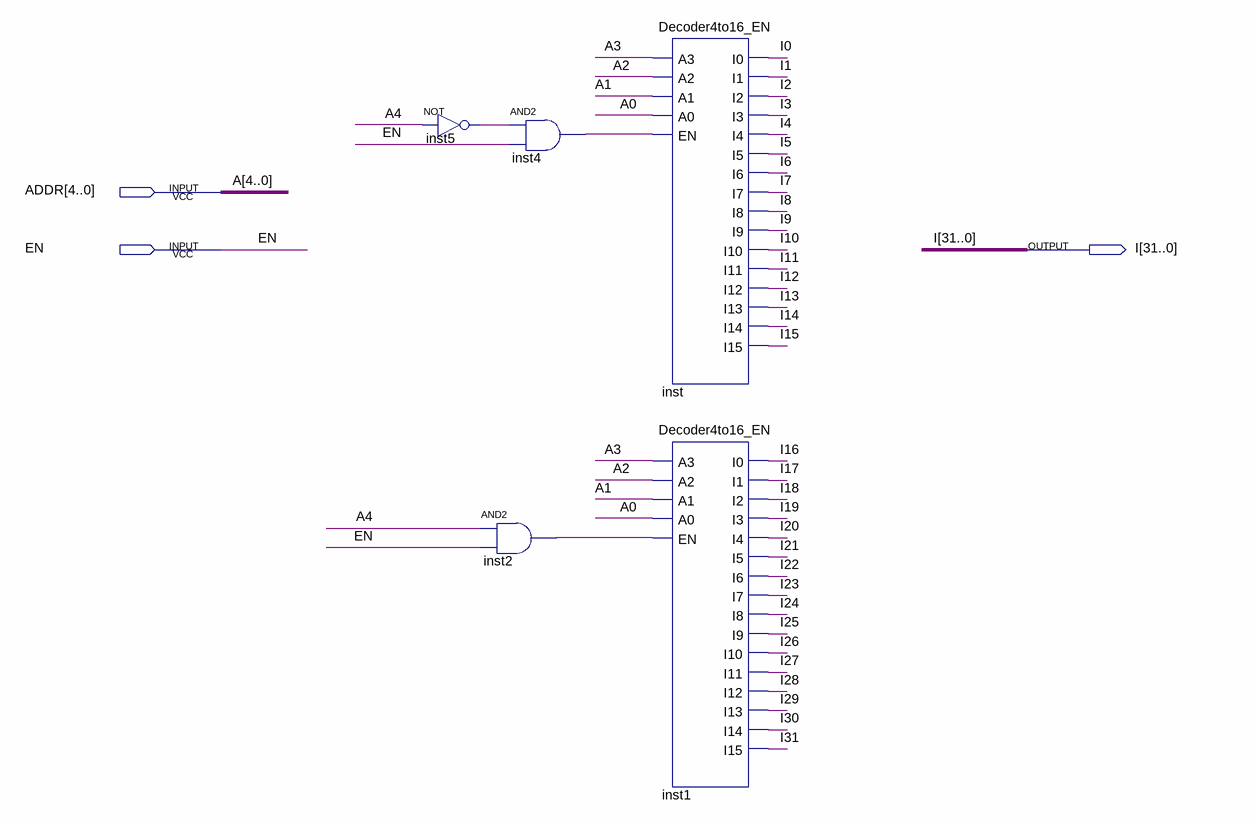
[diagram p0: schematic sheet]
// Quartus schematic Decoder5to32_EN.bdf as structural Verilog: 5 symbols, 3 pins
module Decoder5to32_EN (
  input  [4:0] ADDR,
  input  EN,
  output [31:0] I
);

  wire inst2_out, inst4_out, inst5_out;

  not inst5 (inst5_out, ADDR[4]);
  and inst2 (inst2_out, ADDR[4], EN);
  and inst4 (inst4_out, inst5_out, EN);
  Decoder4to16_EN inst (
    .A3(ADDR[3]), .A2(ADDR[2]), .A1(ADDR[1]), .A0(ADDR[0]), .EN(inst4_out), .I0(I[0]), .I1(I[1]), .I2(I[2]),
    .I3(I[3]), .I4(I[4]), .I5(I[5]), .I6(I[6]), .I7(I[7]), .I8(I[8]), .I9(I[9]), .I10(I[10]), .I11(I[11]),
    .I12(I[12]), .I13(I[13]), .I14(I[14]), .I15(I[15]));
  Decoder4to16_EN inst1 (
    .A3(ADDR[3]), .A2(ADDR[2]), .A1(ADDR[1]), .A0(ADDR[0]), .EN(inst2_out), .I0(I[16]), .I1(I[17]),
    .I2(I[18]), .I3(I[19]), .I4(I[20]), .I5(I[21]), .I6(I[22]), .I7(I[23]), .I8(I[24]), .I9(I[25]),
    .I10(I[26]), .I11(I[27]), .I12(I[28]), .I13(I[29]), .I14(I[30]), .I15(I[31]));

  // Other names for the same wires on the sheet: A[4:0] = ADDR; A0 = ADDR[0]; A1 = ADDR[1]; A2 = ADDR[2];
  //   A3 = ADDR[3]; A4 = ADDR[4]
endmodule
